# Altium schematic sheet SPI_Flash.SchDoc: SPI Flash
size 431 x 279 mm; Author: Alberto Marrone, Christian Schmitz, Leo Walter; DrawnBy: Alberto Marrone, Christian Schmitz, Leo Walter; Engineer: Alberto Marrone, Christian Schmitz, Leo Walter; Revision: V1.0; SheetNumber: 9; Project: PCB Design Final Project
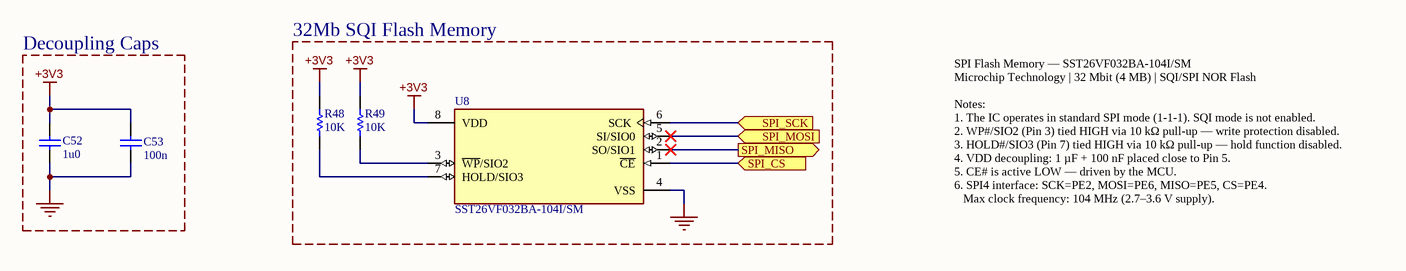
[diagram p0: SPI_Flash.SchDoc]

## Parts
C52  1u0  [0603C]
C53  100n  [0603C]
R48  10K  [0603R]
R49  10K  [0603R]
U8  SST26VF032BA-104I/SM  [FP-C04-056-IPC_A]

## Blocks framed on the sheet
Decoupling Caps: C52 C53
32Mb SQI Flash Memory: R48 R49 U8

## Ports
SPI_CS (in), SPI_MISO (out), SPI_MOSI (in), SPI_SCK (in)

## Nets
+3V3: C52.1 C53.1 R48.1 R49.1 U8.8(VDD)
GND: C52.2 C53.2 U8.4(VSS)
SPI_CS: U8.1(~{CE}) ; port SPI_CS
SPI_MISO: U8.2(SO/SIO1) ; port SPI_MISO
SPI_MOSI: U8.5(SI/SIO0) ; port SPI_MOSI
SPI_SCK: U8.6(SCK) ; port SPI_SCK
NetR48_2: R48.2 U8.7(HOLD/SIO3)
NetR49_2: R49.2 U8.3(~{WP}/SIO2)

## Notes on the sheet
- SPI Flash Memory — SST26VF032BA-104I/SM
  Microchip Technology | 32 Mbit (4 MB) | SQI/SPI NOR Flash
  Notes:
  1. The IC operates in standard SPI mode (1-1-1). SQI mode is not enabled.
  2. WP#/SIO2 (Pin 3) tied HIGH via 10 kΩ pull-up — write protection disabled.
  3. HOLD#/SIO3 (Pin 7) tied HIGH via 10 kΩ pull-up — hold function disabled.
  4. VDD decoupling: 1 µF + 100 nF placed close to Pin 5.
  5. CE# is active LOW — driven by the MCU.
  6. SPI4 interface: SCK=PE2, MOSI=PE6, MISO=PE5, CS=PE4.
  Max clock frequency: 104 MHz (2.7–3.6 V supply).
- DWG. NO.
- REV.
- SHT.
- THIS DOCUMENT AND THE DATA DISCLOSED HEREIN OR HEREWITH IS THE PROPERTY OF ALTIUM LIMITED AND MAY BE FREELY DISTRIBUTED IN WHOLE. NO RIGHTS ARE RESERVED OR EXPRESS OR IMPLIED WARANTEE GIVEN.
- REVISION
- DESCRIPTION
- DATE
- APPROVED
- ENG:
- APPROVALS
- PROJECT
- DSN:
- CHK:
- REFERENCE DOCUMENTS
- PROJECT REVISION:
- TITLE
- DOCUMENT REVISION:
- DESIGN ITEM:
- BOM:
- FAB DWG:
- PCB DWG:
- ASSY DWG:
- SCALE:
- SIZE
- B
- CAGE CODE
- FILE NAME
- DWG NO.
- SHEET
- OF
- REV

## Library data of the parts
C52 = CAP SMD 0603  X5R 1µF 25V 10%: Capacitor; Voltage Rating: 25V; Tolerance: 10%; Dielectric: X5R; Manufacturer: *; Manufacturer P/N: *; Order code Farnell: 1288202RL; Value: 1u0; Power: *; Temperature  Factor: *; Temperature Max: +125°C; Temperature Min: -55°C; STS Code: *
C53 = Cap: Capacitor; Dielectric: X7R; Published: 8-Jun-2000; Revision: July-2002: Re-released for DXP Platform.; Publisher: Altium Limited; Value: 100n
R48 R49 = res1: Resistor; Published: 8-Jun-2000; Revision: July-2002: Re-released for DXP Platform.; Publisher: Altium Limited; Value: 10K
U8 = CMP-06315-000017-1: IC FLASH 32MBIT SPI/QUAD 8SOIJ; Memory Size: 32Mb; Page Size: 256B; Operating Supply Voltage: 3V; Interface: SPI; Frequency: 104MHz; Access Time: 3ns; Min Supply Voltage: 2.7V; Max Supply Voltage: 3.6V; Memory Type: FLASH; Lead Free: Lead Free; Packaging: Rail/Tube; Length: 5.26mm; Mount: Surface Mount; Series: SST26 SQI®; Height: 1.98mm; Density: 32Mb; Number of Pins: 8; Max Operating Temperature: 85°C; Width: 5.25mm; Case/Package: SOIC; Access Time-Max: 3ns; Min Operating Temperature: -40°C; RoHS Compliant: Yes; REACH SVHC: No SVHC